# Altium schematic sheet rlink.schdoc
size 209 x 297 mm
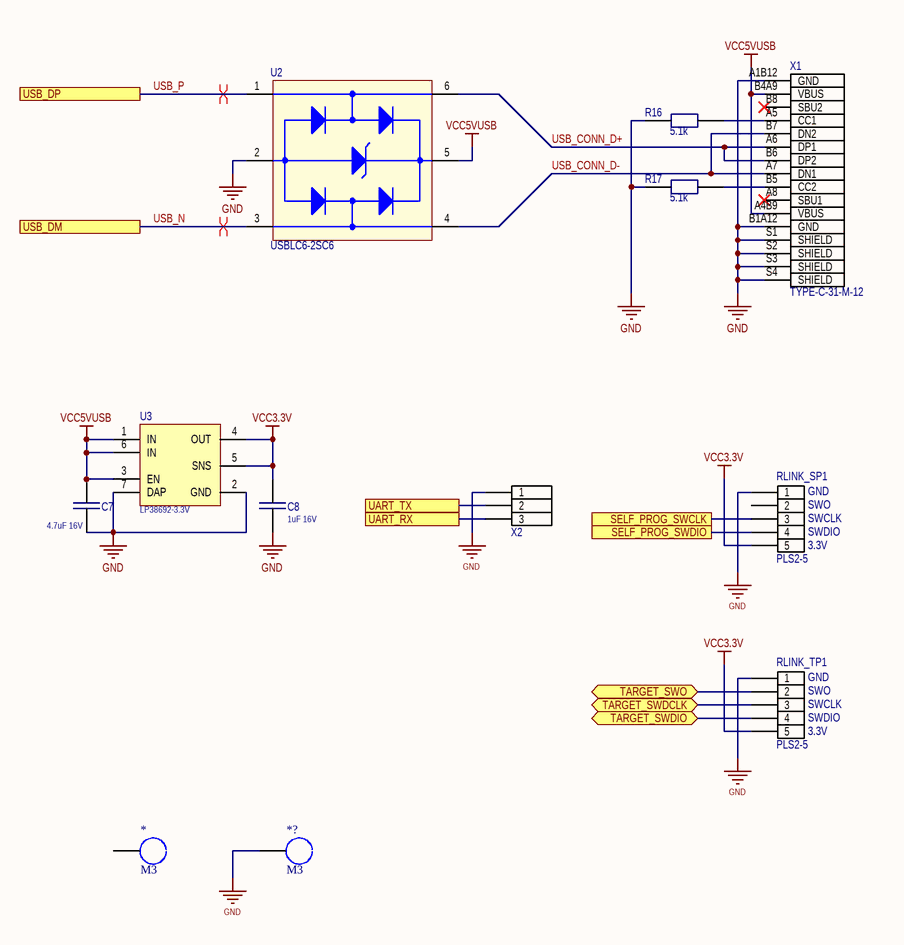
[diagram p0: rlink.schdoc]

## Parts
*  M3  [M3]
*?  M3  [M3]
C7  4.7uF 16V  [C_0402]
C8  1uF 16V  [C_0402]
R16  5.1k  [R_0402]
R17  5.1k  [R_0402]
RLINK_SP1  PLS2-5  [PLS-5- no 3D  model]
RLINK_TP1  PLS2-5  [PLS-5-3D  right angle]
U2  USBLC6-2SC6  [SOT95P280X145-6N]
U3  LP38692-3.3V  [WSON-6]
X1  TYPE-C-31-M-12  [HRO_TYPE-C-31-M-12]
X2  PLS2-3  [PLS-3- no 3D model]  (value not drawn)

## Ports
SELF_PROG_SWCLK, SELF_PROG_SWDIO, TARGET_SWDCLK (bidir), TARGET_SWDIO (bidir), TARGET_SWO (bidir), UART_RX, UART_TX, USB_DM, USB_DP

## Nets
GND: *?.1 C7.1 C8.1 R16.1 R17.1 RLINK_SP1.1 RLINK_TP1.1 U2.2(GND) U3.2(GND) U3.7(DAP) X1.A1B12(GND) X1.B1A12(GND) X1.S1(SHIELD) X1.S2(SHIELD) X1.S3(SHIELD) X1.S4(SHIELD) X2.1
VCC3.3V: C8.2 RLINK_SP1.5 RLINK_TP1.5 U3.4(OUT) U3.5(SNS)
VCC5VUSB: C7.2 U2.5(VBUS) U3.1(IN) U3.3(EN) U3.6(IN) X1.A4B9(VBUS) X1.B4A9(VBUS)
SELF_PROG_SWCLK: RLINK_SP1.3 ; port SELF_PROG_SWCLK
SELF_PROG_SWDIO: RLINK_SP1.4 ; port SELF_PROG_SWDIO
TARGET_SWDCLK: RLINK_TP1.3 ; port TARGET_SWDCLK
TARGET_SWDIO: RLINK_TP1.4 ; port TARGET_SWDIO
TARGET_SWO: RLINK_TP1.2 ; port TARGET_SWO
UART_RX: X2.3 ; port UART_RX
UART_TX: X2.2 ; port UART_TX
USB_CONN_D+: U2.6(I/O1_OUT) X1.A6(DP1) X1.B6(DP2)
USB_CONN_D-: U2.4(I/O2_OUT) X1.A7(DN1) X1.B7(DN2)
USB_N: U2.3(I/O2_IN) ; port USB_DM
USB_P: U2.1(I/O1_IN) ; port USB_DP
NetR16_2: R16.2 X1.A5(CC1)
NetR17_2: R17.2 X1.B5(CC2)

Not connected (* = marked no-connect by the designer): * 1; RLINK_SP1 2; X1 A8(SBU1)* B8(SBU2)*

## Layout directives
differential pair: USB_N, USB_P

## Notes on the sheet
- Подп. и дата
- Инв. № дубл.
- Взам. инв. №
- Инв. № подл.
- Лист
- Изм.
- № докум.
- Подп.
- Дата
- (in symbol PLS2-5) GND; SWO; SWCLK; SWDIO; 3.3V

## Library data of the parts
C7 C8 = C0402: Capacitor
R16 R17 = RES_SMD: Resistor; Part Number: RC0402JR-075K1L; Alternative Part: *; Value: 5.1k
RLINK_SP1 RLINK_TP1 = PLS2-5: Header, 5-Pin; LatestRevisionDate: 17-Jul-2002; LatestRevisionNote: Re-released for DXP Platform.; Publisher: Altium Limited
U2 = USBLC6-2SC6: 17V Clamp 5A (8/20Âµs) Ipp Tvs Diode Surface Mount SOT-23-6; MF: STMicroelectronics; Value: *; Check_prices: https://www.snapeda.com/parts/USBLC6-2SC6/STMicroelectronics/view-part/?ref=eda; MP: USBLC6-2SC6; Purchase-URL: https://pricing.snapeda.com/search/part/USBLC6-2SC6/?ref=eda; Price: None; Availability: In Stock; Package: SOT-23-6 STMicroelectronics; SnapEDA_Link: https://www.snapeda.com/parts/USBLC6-2SC6/STMicroelectronics/view-part/?ref=snap; Part Number: USBLC6-2SC6; Alternative Part: *
U3 = LP38692: LP38690, LP38692 1-A LDO CMOS Linear Regulators  Stable with Ceramic Output Capacitors
X1 = TYPE-C-31-M-12: USB Connectors 24 Receptacle 1 8.94*7.3mm RoHS; Package: None; Availability: Unavailable; Value: *; MP: TYPE-C-31-M-12; Price: None; Part Number: TYPE-C-31-M-12; Alternative Part: *
X2 = PLS2-3: Header, 3-Pin; LatestRevisionDate: 17-Jul-2002; LatestRevisionNote: Re-released for DXP Platform.; Publisher: Altium Limited